# EAGLE design HyperRail_Board_vLED (EAGLE 9.6.2)
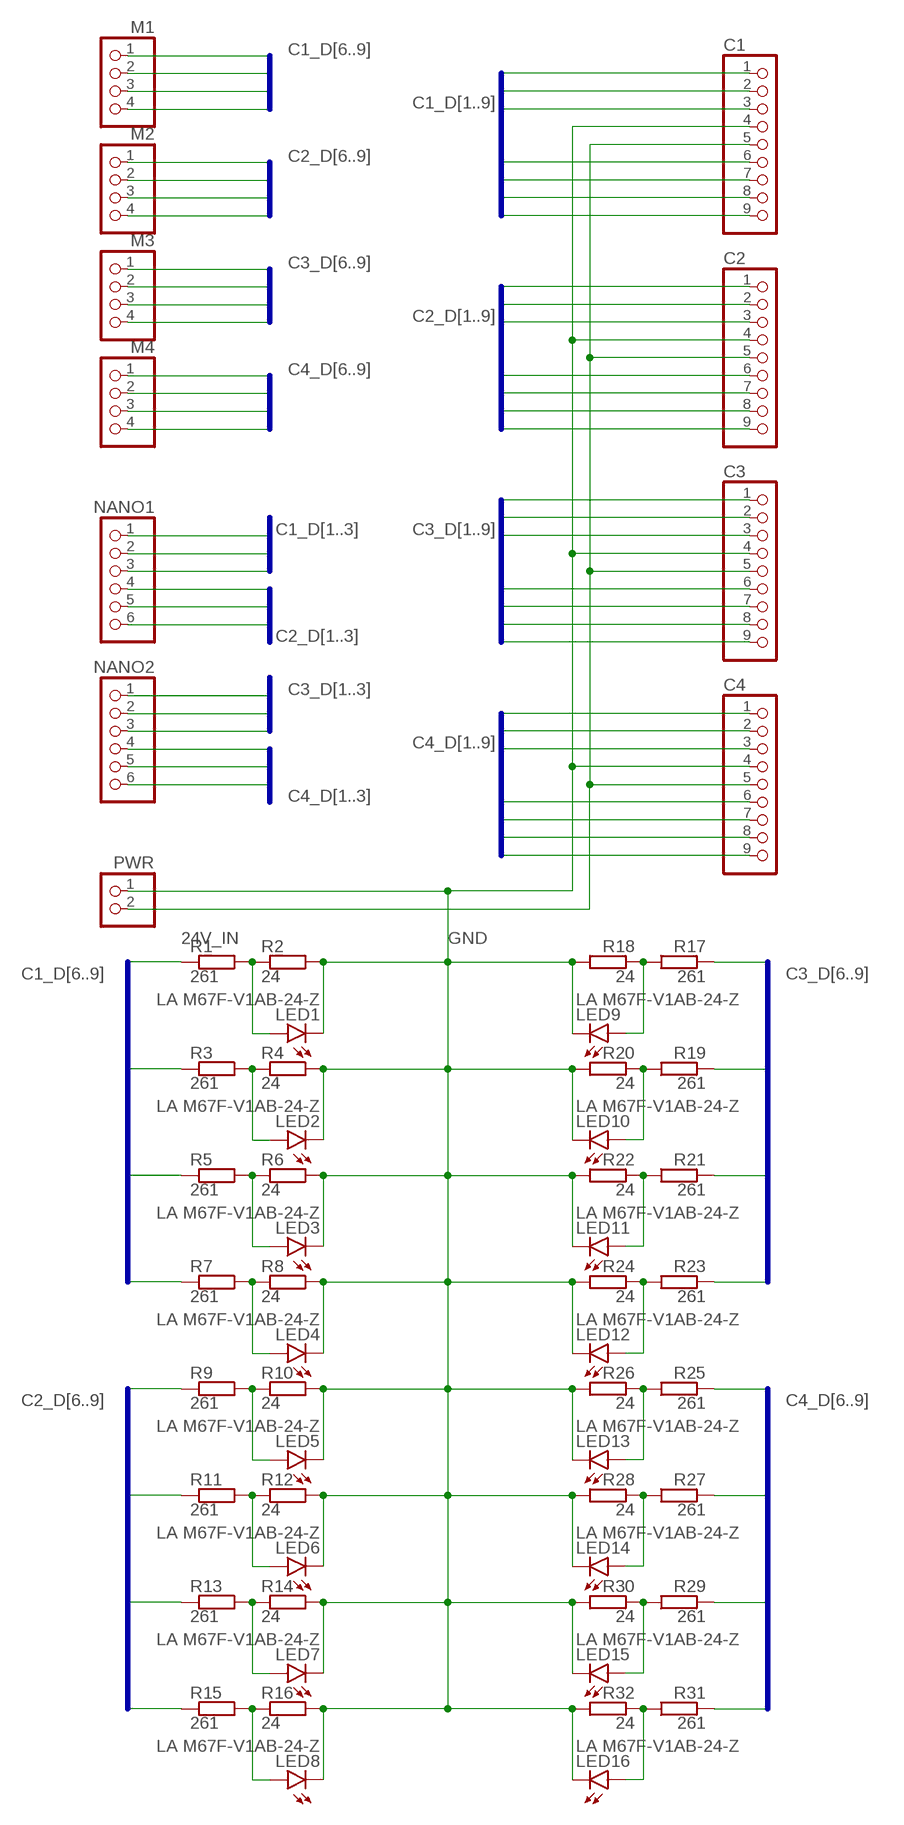
[diagram p0: schematic, sheet 1]

## Parts
C1  PINHD-1X9  [1X09]
C2  PINHD-1X9  [1X09]
C3  PINHD-1X9  [1X09]
C4  PINHD-1X9  [1X09]
LED1  LA M67F-V1AB-24-Z  LY_T679-D2E2-1  [PLCC2]
LED2  LA M67F-V1AB-24-Z  LY_T679-D2E2-1  [PLCC2]
LED3  LA M67F-V1AB-24-Z  LY_T679-D2E2-1  [PLCC2]
LED4  LA M67F-V1AB-24-Z  LY_T679-D2E2-1  [PLCC2]
LED5  LA M67F-V1AB-24-Z  LY_T679-D2E2-1  [PLCC2]
LED6  LA M67F-V1AB-24-Z  LY_T679-D2E2-1  [PLCC2]
LED7  LA M67F-V1AB-24-Z  LY_T679-D2E2-1  [PLCC2]
LED8  LA M67F-V1AB-24-Z  LY_T679-D2E2-1  [PLCC2]
LED9  LA M67F-V1AB-24-Z  LY_T679-D2E2-1  [PLCC2]
LED10  LA M67F-V1AB-24-Z  LY_T679-D2E2-1  [PLCC2]
LED11  LA M67F-V1AB-24-Z  LY_T679-D2E2-1  [PLCC2]
LED12  LA M67F-V1AB-24-Z  LY_T679-D2E2-1  [PLCC2]
LED13  LA M67F-V1AB-24-Z  LY_T679-D2E2-1  [PLCC2]
LED14  LA M67F-V1AB-24-Z  LY_T679-D2E2-1  [PLCC2]
LED15  LA M67F-V1AB-24-Z  LY_T679-D2E2-1  [PLCC2]
LED16  LA M67F-V1AB-24-Z  LY_T679-D2E2-1  [PLCC2]
M1  PINHD-1X4  [1X04]
M2  PINHD-1X4  [1X04]
M3  PINHD-1X4  [1X04]
M4  PINHD-1X4  [1X04]
NANO1  PINHD-1X6  [1X06]
NANO2  PINHD-1X6  [1X06]
PWR  PINHD-1X2  [1X02]
R1  261  SMK  [SMK]
R2  24  SMK  [SMK]
R3  261  SMK  [SMK]
R4  24  SMK  [SMK]
R5  261  SMK  [SMK]
R6  24  SMK  [SMK]
R7  261  SMK  [SMK]
R8  24  SMK  [SMK]
R9  261  SMK  [SMK]
R10  24  SMK  [SMK]
R11  261  SMK  [SMK]
R12  24  SMK  [SMK]
R13  261  SMK  [SMK]
R14  24  SMK  [SMK]
R15  261  SMK  [SMK]
R16  24  SMK  [SMK]
R17  261  SMK  [SMK]
R18  24  SMK  [SMK]
R19  261  SMK  [SMK]
R20  24  SMK  [SMK]
R21  261  SMK  [SMK]
R22  24  SMK  [SMK]
R23  261  SMK  [SMK]
R24  24  SMK  [SMK]
R25  261  SMK  [SMK]
R26  24  SMK  [SMK]
R27  261  SMK  [SMK]
R28  24  SMK  [SMK]
R29  261  SMK  [SMK]
R30  24  SMK  [SMK]
R31  261  SMK  [SMK]
R32  24  SMK  [SMK]

## Nets
24V_IN: C1.5 C2.5 C3.5 C4.5 PWR.2
C1_D1: C1.1 NANO1.1
C1_D2: C1.2 NANO1.2
C1_D3: C1.3 NANO1.3
C1_D6: C1.6 M1.1 R1.2
C1_D7: C1.7 M1.2 R3.2
C1_D8: C1.8 M1.3 R5.2
C1_D9: C1.9 M1.4 R7.2
C2_D1: C2.1 NANO1.4
C2_D2: C2.2 NANO1.5
C2_D3: C2.3 NANO1.6
C2_D6: C2.6 M2.1 R9.2
C2_D7: C2.7 M2.2 R11.2
C2_D8: C2.8 M2.3 R13.2
C2_D9: C2.9 M2.4 R15.2
C3_D1: C3.1 NANO2.1
C3_D2: C3.2 NANO2.2
C3_D3: C3.3 NANO2.3
C3_D6: C3.6 M3.1 R17.2
C3_D7: C3.7 M3.2 R19.2
C3_D8: C3.8 M3.3 R21.2
C3_D9: C3.9 M3.4 R23.2
C4_D1: C4.1 NANO2.4
C4_D2: C4.2 NANO2.5
C4_D3: C4.3 NANO2.6
C4_D6: C4.6 M4.1 R25.2
C4_D7: C4.7 M4.2 R27.2
C4_D8: C4.8 M4.3 R29.2
C4_D9: C4.9 M4.4 R31.2
GND: C1.4 C2.4 C3.4 C4.4 LED1.C LED2.C LED3.C LED4.C LED5.C LED6.C LED7.C LED8.C LED9.C LED10.C LED11.C LED12.C LED13.C LED14.C LED15.C LED16.C PWR.1 R2.1 R4.1 R6.1 R8.1 R10.1 R12.1 R14.1 R16.1 R18.1 R20.1 R22.1 R24.1 R26.1 R28.1 R30.1 R32.1
N$1: LED1.A R1.1 R2.2
N$2: LED2.A R3.1 R4.2
N$3: LED3.A R5.1 R6.2
N$4: LED4.A R7.1 R8.2
N$5: LED5.A R9.1 R10.2
N$6: LED6.A R11.1 R12.2
N$7: LED7.A R13.1 R14.2
N$8: LED8.A R15.1 R16.2
N$9: LED9.A R17.1 R18.2
N$10: LED10.A R19.1 R20.2
N$11: LED11.A R21.1 R22.2
N$12: LED12.A R23.1 R24.2
N$13: LED13.A R25.1 R26.2
N$14: LED14.A R27.1 R28.2
N$15: LED15.A R29.1 R30.2
N$16: LED16.A R31.1 R32.2

## Buses
C1_D[1..3]
C2_D[1..3]
C3_D[1..3]
C4_D[1..3]
C1_D[1..9]
C2_D[1..9]
C3_D[1..9]
C4_D[1..9]
C1_D[6..9]
C2_D[6..9]
C4_D[6..9]
C3_D[6..9]

## Library data of the parts
C1-C4 = pinhead:PINHD-1X9: PIN HEADER
LED1-LED16 = led:*_T679-?-1: LC TOPLED® Low Current LED Source: http://catalog.osram-os.com .. LG_LS_LY_T679_OBS.pdf; COLOR: yellow
M1-M4 = pinhead:PINHD-1X4: PIN HEADER
NANO1 NANO2 = pinhead:PINHD-1X6: PIN HEADER
PWR = pinhead:PINHD-1X2: PIN HEADER
R1-R32 = resistor-shunt:SMK: SMD SHUNT RESISTOR; OC_FARNELL: unknown; OC_NEWARK: unknown

## Net classes
0 default: width 0.406 mm, drill 0.132 mm

## Board
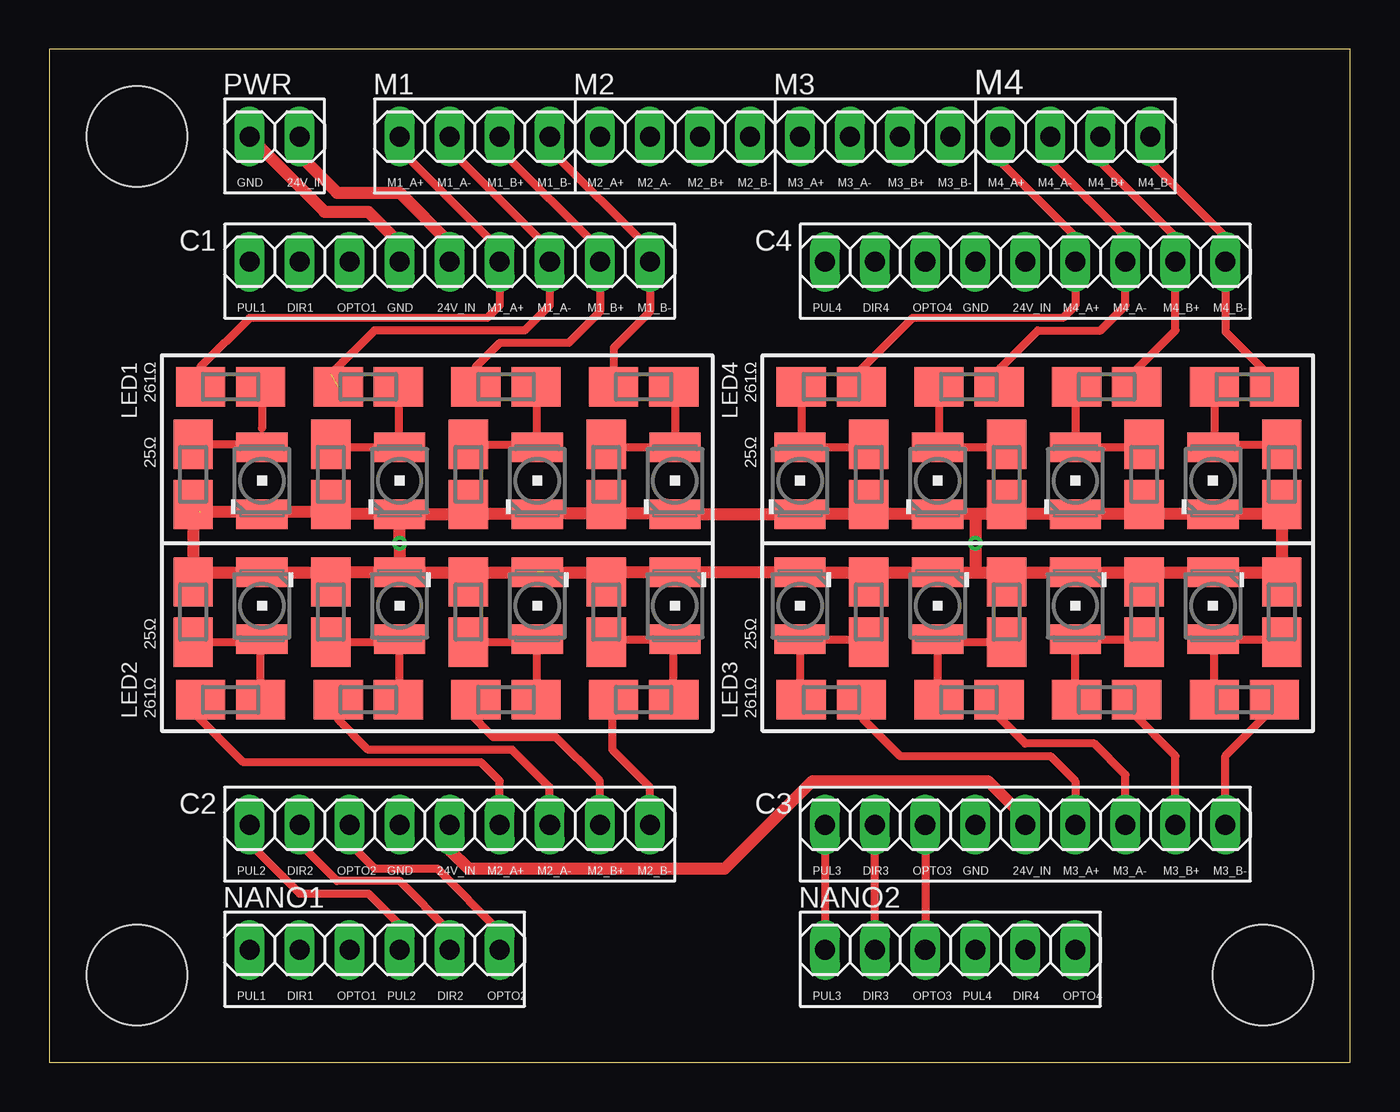
[diagram p1: board, top side]
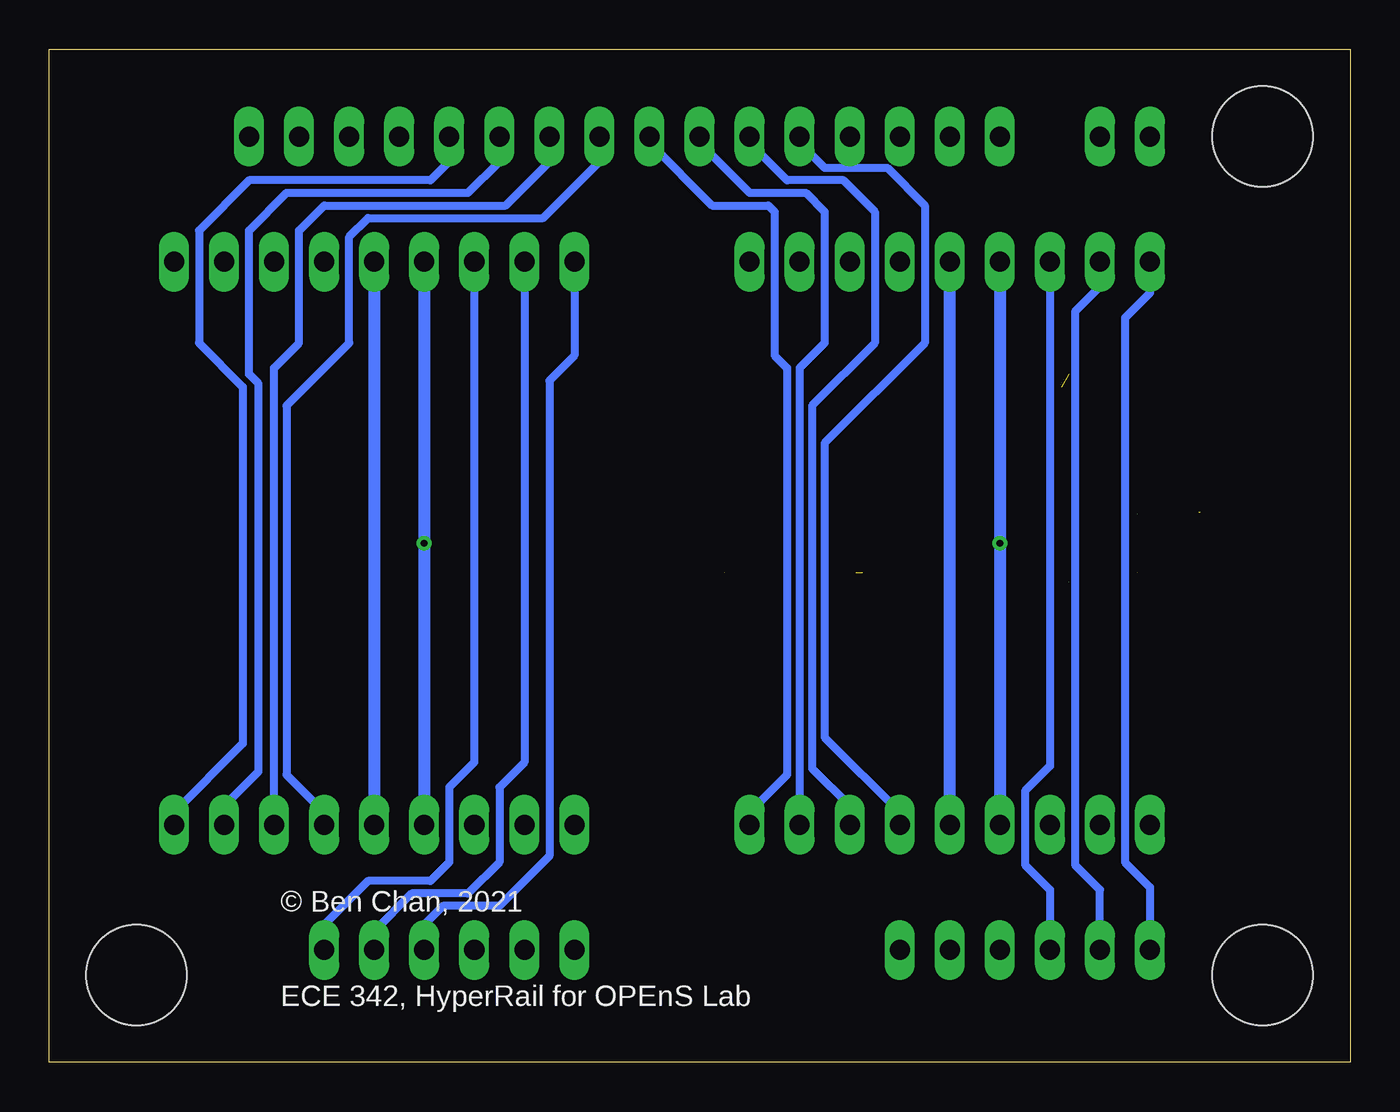
[diagram p2: board, bottom side, seen from below]

Size 66.02 x 51.42 mm. Coordinates in mm from the lower left corner, seen from the top.
Outline: 0,0 66.02,0 66.02,51.42 0,51.42 0,0
Copper layers (1*16): Top 0.035mm / dielectric 1.5mm / Bottom 0.035mm
Design rules "default *": minimum track width 12mil, minimum drill 0.35mm, track to track 6mil, track to pad 6mil, pad to pad 6mil, via to via 6mil, smd to smd 6mil, copper to edge 40mil, drill to drill 6mil, minimum pad ring 10mil, minimum via ring 8mil, stop-mask expansion 4mil, vias tented up to drill 0mil, thermal gap 10mil
Holes 5.11 mm at 4.44,46.99 4.44,4.44 61.59,4.44

### Footprints (pad centres in the part's own frame; a part is rotated, then mirrored left to right if it is on the bottom)
1X09 = drill 1.016 long: 1 -10.16,0; 2 -7.62,0; 3 -5.08,0; 4 -2.54,0; 5 0,0; 6 2.54,0; 7 5.08,0; 8 7.62,0; 9 10.16,0
PLCC2 = smd 2.6 x 1.5: A 0,1.7; C 0,-1.7
1X04 = drill 1.016 long: 1 -3.81,0; 2 -1.27,0; 3 1.27,0; 4 3.81,0
1X06 = drill 1.016 long: 1 -6.35,0; 2 -3.81,0; 3 -1.27,0; 4 1.27,0; 5 3.81,0; 6 6.35,0
1X02 = drill 1.016 long: 1 -1.27,0; 2 1.27,0
SMK = smd 2.5 x 2: 1 1.524,0; 2 -1.524,0

### Placement (x,y rotation side)
C1  20.32,40.64 0 top
C2  20.32,12.06 0 top
C3  49.53,12.06 0 top
C4  49.53,40.64 0 top
LED1  10.79,29.53 0 top
LED2  17.78,29.53 0 top
LED3  24.77,29.53 0 top
LED4  31.75,29.53 0 top
LED5  10.79,23.18 180 top
LED6  17.78,23.18 180 top
LED7  24.77,23.18 180 top
LED8  31.75,23.18 180 top
LED9  38.1,23.18 180 top
LED10  45.09,23.18 180 top
LED11  52.07,23.18 180 top
LED12  59.05,23.18 180 top
LED13  38.1,29.53 0 top
LED14  45.09,29.53 0 top
LED15  52.07,29.53 0 top
LED16  59.05,29.53 0 top
M1  21.59,46.99 0 top
M2  31.75,46.99 0 top
M3  41.91,46.99 0 top
M4  52.07,46.99 0 top
NANO1  16.51,5.72 0 top
NANO2  45.72,5.72 0 top
PWR  11.43,46.99 0 top
R1  9.21,34.29 0 top
R2  7.3,29.84 270 top
R3  16.19,34.29 0 top
R4  14.29,29.84 270 top
R5  23.18,34.29 0 top
R6  21.27,29.84 270 top
R7  30.16,34.29 0 top
R8  28.26,29.84 270 top
R9  9.21,18.41 0 top
R10  7.3,22.86 90 top
R11  16.19,18.41 0 top
R12  14.29,22.86 90 top
R13  23.18,18.41 0 top
R14  21.27,22.86 90 top
R15  30.16,18.41 0 top
R16  28.26,22.86 90 top
R17  39.69,18.41 180 top
R18  41.59,22.86 90 top
R19  46.67,18.41 180 top
R20  48.58,22.86 90 top
R21  53.66,18.41 180 top
R22  55.56,22.86 90 top
R23  60.64,18.41 180 top
R24  62.55,22.86 90 top
R25  39.69,34.29 180 top
R26  41.59,29.84 270 top
R27  46.67,34.29 180 top
R28  48.58,29.84 270 top
R29  53.66,34.29 180 top
R30  55.56,29.84 270 top
R31  60.64,34.29 180 top
R32  62.55,29.84 270 top

### Tracks (layer width: path | path; a pad name or v marks a point on that pad's centre or on a via)
24V_IN
  Top 0.406: C2.5 20.32,10.8 | 49.53,12.38 C3.5
  Top 0.508: PWR.2 12.7,46.04
  Top 0.61: 12.7,46.04 14.61,44.13 17.78,44.13 20.32,41.59 C1.5 | 20.32,10.8 21.27,9.84 34.29,9.84 38.73,14.29 47.62,14.29 49.53,12.38
  Bottom 0.61: C4.5 C3.5 | C2.5 C1.5
C1_D1
  Bottom 0.406: C1.1 10.16,39.05 11.43,37.78 11.43,10.16 10.16,8.89 NANO1.1
C1_D2
  Bottom 0.406: NANO1.2 12.7,8.77 13.97,10.04 13.97,38.1 12.7,39.37 C1.2
C1_D3
  Bottom 0.406: C1.3 15.24,15.04 16.51,13.77 16.51,10.04 15.24,8.77 NANO1.3
C1_D6
  Top 0.406: M1.1 17.78,46.36 22.86,41.27 C1.6 22.86,38.42 22.23,37.78 10.16,37.78 7.68,35.31 R1.2
C1_D7  (1 unrouted)
  Top 0.406: M1.2 20.32,46.36 25.4,41.27 C1.7 25.4,38.42 24.13,37.15 16.51,37.15 14.29,34.92
C1_D8
  Top 0.406: M1.3 22.86,46.36 27.94,41.27 C1.8 27.94,38.1 26.35,36.51 22.86,36.51 21.65,35.31 R5.2
C1_D9
  Top 0.406: M1.4 25.4,46.36 30.48,41.27 C1.9 30.48,38.1 28.64,36.26 R7.2
C2_D1
  Top 0.406: C2.1 10.16,11.11 12.7,8.57 16.19,8.57 17.78,6.98 NANO1.4
C2_D2
  Top 0.406: C2.2 12.7,11.11 14.61,9.21 17.78,9.21 20.32,6.67 NANO1.5
C2_D3
  Top 0.406: C2.3 15.24,11.11 16.51,9.84 19.69,9.84 22.86,6.67 NANO1.6
C2_D6
  Top 0.406: R9.2 7.3,18.03 7.3,17.78 9.84,15.24 21.91,15.24 22.86,14.29 C2.6
  Bottom 0.406: M2.1 27.94,46.67 26.67,45.4 23.49,45.4 21.59,43.5 21.59,36.51 26.67,31.43 26.67,16.51 22.86,12.7 C2.6
C2_D7
  Top 0.406: R11.2 14.67,17.4 16.19,15.88 23.49,15.88 25.4,13.97 C2.7
  Bottom 0.406: M2.2 30.48,46.67 | 30.48,46.67 30.48,46.36 | 30.48,46.67 28.58,44.77 25.72,44.77 24.13,43.18 24.13,36.51 27.3,33.34 27.3,14.92 25.4,13.02 C2.7
C2_D8
  Top 0.406: C2.8 27.94,14.29 25.72,16.51 22.54,16.51 21.27,17.78 21.27,18.03 R13.2
  Bottom 0.406: M2.3 33.02,46.67 30.48,44.13 27.62,44.13 26.67,43.18 26.67,36.51 27.94,35.24 C2.8
C2_D9
  Top 0.406: R15.2 28.58,18.35 28.58,15.88 30.48,13.97 C2.9
  Bottom 0.406: M2.4 35.56,46.67 32.38,43.5 29.53,43.5 29.21,43.18 29.21,35.88 28.58,35.24 28.58,14.61 30.48,12.7 C2.9
C3_D1
  Top 0.406: C3.1 NANO2.1
C3_D2
  Top 0.406: NANO2.2 C3.2
C3_D3
  Top 0.406: C3.3 NANO2.3
C3_D6
  Top 0.406: R17.2 41.27,18.35 41.27,17.46 43.18,15.56 50.8,15.56 52.07,14.29 C3.6
  Bottom 0.406: C3.6 52.07,12.7 53.98,14.61 53.98,33.34 50.8,36.51 50.8,41.91 49.85,42.86 40.96,42.86 38.1,45.72 M3.1
C3_D7
  Top 0.406: R19.2 48.2,17.53 49.53,16.19 53.02,16.19 54.61,14.61 C3.7
  Bottom 0.406: M3.2 40.64,45.72 42.86,43.5 52.07,43.5 53.34,42.23 53.34,36.51 54.61,35.24 C3.7
C3_D8
  Top 0.406: C3.8 57.15,15.56 54.93,17.78 54.93,18.16 R21.2
  Bottom 0.406: C3.8 57.15,13.02 55.4,14.76 55.4,34.45 55.88,34.92 55.88,42.23 53.98,44.13 44.77,44.13 43.18,45.72 M3.3
C3_D9
  Top 0.406: R23.2 62.17,18.03 59.69,15.56 C3.9
  Bottom 0.406: C3.9 59.69,12.7 56.2,16.19 56.2,34.29 58.42,36.51 58.42,42.23 55.88,44.77 46.67,44.77 45.72,45.72 M3.4
C4_D1
  Bottom 0.406: C4.1 39.37,35.88 40.64,34.61 40.64,10.48 43.18,7.94 46.04,7.94 46.99,6.98 NANO2.4
C4_D2
  Bottom 0.406: C4.2 41.91,15.24 43.18,13.97 43.18,10.16 44.77,8.57 47.62,8.57 49.53,6.67 NANO2.5
C4_D3
  Bottom 0.406: C4.3 44.45,15.24 45.72,13.97 45.72,10.16 46.67,9.21 49.85,9.21 52.07,6.98 NANO2.6
C4_D6
  Top 0.406: M4.1 48.26,45.72 52.07,41.91 C4.6 52.07,38.42 51.44,37.78 43.82,37.78 41.21,35.18 R25.2
C4_D7
  Top 0.406: M4.2 50.8,45.72 54.61,41.91 C4.7 54.61,38.42 53.34,37.15 50.16,37.15 48.26,35.24 48.26,34.35 R27.2
C4_D8
  Top 0.406: M4.3 53.34,45.72 57.15,41.91 C4.8 57.15,37.15 55.18,35.18 R29.2
C4_D9
  Top 0.406: M4.4 55.88,45.72 59.69,41.91 C4.9 59.69,37.08 62.17,34.61 R31.2
GND  (via drill 0.35)  (6 unrouted)
  Top 0.61: R16.1 28.45,24.58 | 28.45,24.58 28.75,24.88 LED8.C | 17.46,28.14 LED2.C | LED2.C 18.1,28.14 | 21.1,28.14 R6.1 21.08,28.13 | 24.27,28.32 LED3.C | 21.08,28.13 20.78,27.83 LED2.C | 31.26,28.32 31.69,27.88 | 31.69,27.88 LED4.C LED13.C 41.91,27.83 | R14.1 21.46,24.58 | 21.46,24.58 21.77,24.88 25.08,24.88 | 14.64,24.73 R12.1 14.29,24.67 14.49,24.88 | 14.64,24.73 14.78,24.88 LED6.C | 7.68,27.94 10.68,27.94 LED1.C 10.91,27.94 14.29,27.94 | 7.62,27.94 7.68,27.94 R2.1 R10.1 7.8,24.88 LED5.C 14.49,24.88 | 14.49,24.88 14.64,24.73 | LED6.C 21.16,24.88 21.46,24.58 | LED7.C 28.15,24.88 28.45,24.58 | LED3.C 21.8,27.83 21.59,27.62 21.27,27.62 21.08,27.81 21.08,28.13 | R8.1 28.7,27.88 | 28.7,27.88 31.69,27.88 | LED3.C 24.82,27.88 28.7,27.88 | LED8.C | 55.56,27.83 LED16.C 62.05,27.83 R32.1 R24.1 | 55.56,27.83 LED15.C 48.58,27.83 | 48.58,27.83 46.99,27.83 | 46.99,27.83 LED14.C 41.91,27.83 | LED10.C LED9.C LED8.C | 62.23,24.77 62.12,24.88 LED12.C | R18.1 42.09,24.88 LED10.C | 48.08,24.88 LED11.C 55.88,24.88 | 55.88,24.88 LED12.C | LED10.C 46.99,24.88 | 46.99,24.88 48.08,24.88 | 48.08,24.88 R20.1 | R22.1 55.88,24.7 | 55.88,24.7 55.94,24.77 | 55.88,24.7 55.88,24.88 | R30.1 55.56,27.83 | R28.1 48.58,27.83 | R26.1 41.59,28.14 41.91,27.83 | LED2.C v17.78,26.35 LED6.C | LED6.C | 46.99,27.83 v46.99,26.35 46.99,24.88 | PWR.1 13.97,43.18 16.19,43.18 17.78,41.59 C1.4 | LED2.C 14.4,27.83 14.29,27.94 | R4.1 14.29,27.94 | LED12.C 58.94,24.77
  Bottom 0.61: C4.4 v46.99,26.35 C3.4 | C1.4 v17.78,26.35 C2.4
N$1
  Top 0.406: R1.1 10.79,34.23 10.79,32.18 | LED1.A 10.65,31.37 R2.2
N$2
  Top 0.406: R3.1 17.72,31.29 LED2.A 14.43,31.23 R4.2
N$3
  Top 0.406: R6.2 24.62,31.37 LED3.A | LED3.A 24.77,34.23 R5.1
N$4
  Top 0.406: R8.2 28.4,31.23 LED4.A | R7.1 31.75,34.23 LED4.A
N$5
  Top 0.406: R9.1 10.73,21.41 LED5.A 10.65,21.34 R10.2
N$6
  Top 0.406: R11.1 17.78,18.48 LED6.A 17.64,21.34 R12.2
N$7
  Top 0.406: R13.1 24.77,18.48 LED7.A 24.62,21.34 R14.2
N$8
  Top 0.406: R15.1 31.69,21.41 LED8.A 28.4,21.48 R16.2
N$9
  Top 0.406: R18.2 41.45,21.48 LED9.A 38.1,18.48 R17.1
N$10
  Top 0.406: R19.1 45.09,18.48 LED10.A 45.23,21.34 R20.2
N$11
  Top 0.406: R21.1 52.07,18.48 LED11.A 55.42,21.48 R22.2
N$12
  Top 0.406: R23.1 59.12,21.41 LED12.A 62.41,21.48 R24.2
N$13
  Top 0.406: R25.1 38.16,31.29 LED13.A 41.45,31.23 R26.2
N$14
  Top 0.406: R27.1 45.15,31.29 LED14.A 48.58,31.23 | 48.58,31.23 48.69,31.23 49.21,31.75 | R28.2 48.58,31.23
N$15
  Top 0.406: R29.1 52.07,34.23 LED15.A 55.42,31.23 R30.2
N$16
  Top 0.406: 62.32,31.23 R32.2 59.2,31.37 LED16.A 59.12,31.29 R31.1

### Text on the board
tPlace: GND | 24V_IN | M1_A+ | M1_A- | M1_B+ | M1_B- | M2_A+ | M2_A- | M2_B+ | M2_B- | M3_A+ | M3_A- | M3_B+ | M3_B- | M4_A+ | M4_A- | M4_B+ | M4_B- | PUL1 | DIR1 | OPTO1 | GND | 24V_IN | M1_A+ | M1_A- | M1_B+ | M1_B- | PUL4 | DIR4 | OPTO4 | GND | 24V_IN | M4_A+ | M4_A- | M4_B+ | M4_B- | 261Ω | 261Ω | 25Ω | 25Ω | 25Ω | 25Ω | 261Ω | 261Ω | PUL2 | DIR2 | OPTO2 | GND | 24V_IN | M2_A+ | M2_A- | M2_B+ | M2_B- | PUL3 | DIR3 | OPTO3 | GND | 24V_IN | M3_A+ | M3_A- | M3_B+ | M3_B- | PUL1 | DIR1 | OPTO1 | PUL2 | DIR2 | OPTO2 | PUL3 | DIR3 | OPTO3 | PUL4 | DIR4 | OPTO4
tNames: LED1 | LED4 | LED2 | LED3
bNames: © Ben Chan, 2021 / / / ECE 342, HyperRail for OPEnS Lab